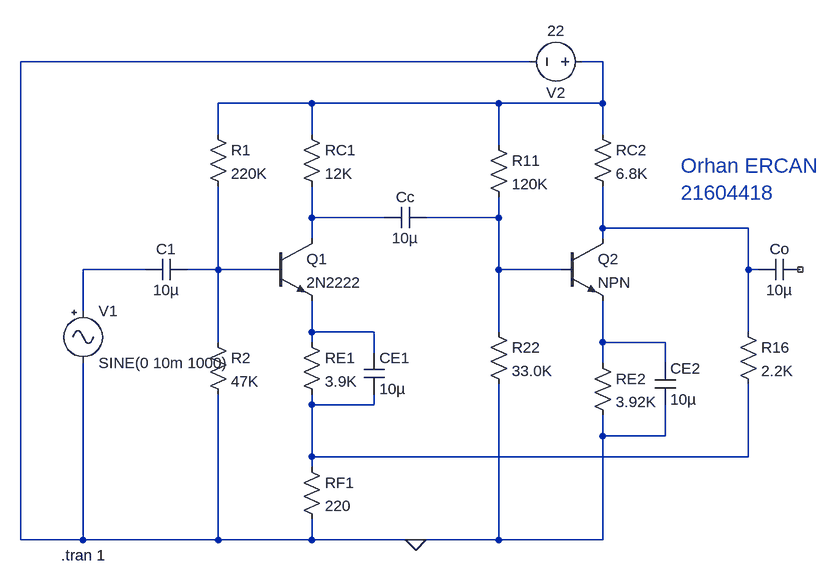
[diagram p0: schematic Draft1.asc]
Draft1.asc, the LTspice schematic file:
Version 4
SHEET 1 1160 680
WIRE 512 -144 -272 -144
WIRE 624 -144 592 -144
WIRE 176 -80 32 -80
WIRE 464 -80 176 -80
WIRE 624 -80 624 -144
WIRE 624 -80 464 -80
WIRE 32 -32 32 -80
WIRE 176 -32 176 -80
WIRE 624 -32 624 -80
WIRE 464 -16 464 -80
WIRE 176 96 176 48
WIRE 288 96 176 96
WIRE 464 96 464 64
WIRE 464 96 352 96
WIRE 624 112 624 48
WIRE 848 112 624 112
WIRE 176 128 176 96
WIRE 624 128 624 112
WIRE -80 176 -176 176
WIRE 32 176 32 48
WIRE 32 176 -16 176
WIRE 112 176 32 176
WIRE 464 176 464 96
WIRE 560 176 464 176
WIRE 848 176 848 112
WIRE 864 176 848 176
WIRE -176 240 -176 176
WIRE 176 272 176 224
WIRE 272 272 176 272
WIRE 464 272 464 176
WIRE 848 272 848 176
WIRE 32 288 32 176
WIRE 176 288 176 272
WIRE 624 288 624 224
WIRE 720 288 624 288
WIRE 272 304 272 272
WIRE 624 320 624 288
WIRE 720 320 720 288
WIRE 176 384 176 368
WIRE 272 384 272 368
WIRE 272 384 176 384
WIRE 624 432 624 400
WIRE 720 432 720 384
WIRE 720 432 624 432
WIRE 176 464 176 384
WIRE 848 464 848 352
WIRE 848 464 176 464
WIRE 176 480 176 464
WIRE -272 592 -272 -144
WIRE -176 592 -176 320
WIRE -176 592 -272 592
WIRE 32 592 32 368
WIRE 32 592 -176 592
WIRE 176 592 176 560
WIRE 176 592 32 592
WIRE 336 592 176 592
WIRE 464 592 464 352
WIRE 464 592 336 592
WIRE 624 592 624 432
WIRE 624 592 464 592
FLAG 336 592 0
SYMBOL npn 112 128 R0
SYMATTR InstName Q1
SYMATTR Value 2N2222
SYMBOL npn 560 128 R0
SYMATTR InstName Q2
SYMBOL cap -16 160 R90
WINDOW 0 0 32 VBottom 2
WINDOW 3 32 32 VTop 2
SYMATTR InstName C1
SYMATTR Value 10µ
SYMATTR SpiceLine V=6.3 Irms=0 Rser=0.001 Lser=0 mfg="TDK" pn="C3216X5ROJ106M" type="X5R"
SYMBOL cap 704 320 R0
SYMATTR InstName CE2
SYMATTR Value 10µ
SYMATTR SpiceLine V=6.3 Irms=0 Rser=0.001 Lser=0 mfg="TDK" pn="C3216X5ROJ106M" type="X5R"
SYMBOL cap 352 80 R90
WINDOW 0 0 32 VBottom 2
WINDOW 3 32 32 VTop 2
SYMATTR InstName Cc
SYMATTR Value 10µ
SYMATTR SpiceLine V=6.3 Irms=0 Rser=0.001 Lser=0 mfg="TDK" pn="C3216X5ROJ106M" type="X5R"
SYMBOL res 160 272 R0
SYMATTR InstName RE1
SYMATTR Value 3.9K
SYMATTR SpiceLine tol=1 pwr=0.1
SYMBOL res 160 -48 R0
SYMATTR InstName RC1
SYMATTR Value 12K
SYMATTR SpiceLine tol=1 pwr=0.1
SYMBOL res 16 -48 R0
SYMATTR InstName R1
SYMATTR Value 220K
SYMATTR SpiceLine tol=1 pwr=0.1
SYMBOL res 16 272 R0
SYMATTR InstName R2
SYMATTR Value 47K
SYMATTR SpiceLine tol=1 pwr=0.1
SYMBOL res 608 304 R0
SYMATTR InstName RE2
SYMATTR Value 3.92K
SYMATTR SpiceLine tol=1 pwr=0.1
SYMBOL res 608 -48 R0
SYMATTR InstName RC2
SYMATTR Value 6.8K
SYMATTR SpiceLine tol=1 pwr=0.1
SYMBOL res 448 -32 R0
SYMATTR InstName R11
SYMATTR Value 120K
SYMATTR SpiceLine tol=1 pwr=0.1
SYMBOL res 160 464 R0
SYMATTR InstName RF1
SYMATTR Value 220
SYMATTR SpiceLine tol=1 pwr=0.1
SYMBOL res 832 256 R0
SYMATTR InstName R16
SYMATTR Value 2.2K
SYMATTR SpiceLine tol=1 pwr=0.1
SYMBOL res 448 256 R0
SYMATTR InstName R22
SYMATTR Value 33.0K
SYMATTR SpiceLine tol=1 pwr=0.1
SYMBOL cap 928 160 R90
WINDOW 0 0 32 VBottom 2
WINDOW 3 32 32 VTop 2
SYMATTR InstName Co
SYMATTR Value 10µ
SYMATTR SpiceLine V=6.3 Irms=0 Rser=0.001 Lser=0 mfg="TDK" pn="C3216X5ROJ106M" type="X5R"
SYMBOL Misc\\signal -176 224 R0
WINDOW 123 0 0 Left 0
WINDOW 39 0 0 Left 0
SYMATTR InstName V1
SYMATTR Value SINE(0 10m 1000)
SYMBOL cap 256 304 R0
SYMATTR InstName CE1
SYMATTR Value 10µ
SYMATTR SpiceLine V=6.3 Irms=0 Rser=0.001 Lser=0 mfg="TDK" pn="C3216X5ROJ106M" type="X5R"
SYMBOL voltage 608 -144 R90
WINDOW 0 32 56 VTop 2
WINDOW 3 -32 56 VBottom 2
WINDOW 123 0 0 Left 0
WINDOW 39 0 0 Left 0
SYMATTR InstName V2
SYMATTR Value 22
TEXT -210 616 Left 2 !.tran 1
TEXT 744 16 Left 3 ;Orhan ERCAN\n21604418

The netlist it stands for:
* Draft1.asc
Q1 N002 N006 N007 0 2N2222
Q2 N004 N003 N008 0 NPN
C1 N006 N005 10µ V=6.3 Irms=0 Rser=0.001 Lser=0 mfg="TDK" pn="C3216X5ROJ106M" type="X5R"
CE2 N008 0 10µ V=6.3 Irms=0 Rser=0.001 Lser=0 mfg="TDK" pn="C3216X5ROJ106M" type="X5R"
Cc N003 N002 10µ V=6.3 Irms=0 Rser=0.001 Lser=0 mfg="TDK" pn="C3216X5ROJ106M" type="X5R"
RE1 N007 N009 3.9K tol=1 pwr=0.1
RC1 N001 N002 12K tol=1 pwr=0.1
R1 N001 N006 220K tol=1 pwr=0.1
R2 N006 0 47K tol=1 pwr=0.1
RE2 N008 0 3.92K tol=1 pwr=0.1
RC2 N001 N004 6.8K tol=1 pwr=0.1
R11 N001 N003 120K tol=1 pwr=0.1
RF1 N009 0 220 tol=1 pwr=0.1
R16 N004 N009 2.2K tol=1 pwr=0.1
R22 N003 0 33.0K tol=1 pwr=0.1
Co NC_01 N004 10µ V=6.3 Irms=0 Rser=0.001 Lser=0 mfg="TDK" pn="C3216X5ROJ106M" type="X5R"
V1 N005 0 SINE(0 10m 1000)
CE1 N007 N009 10µ V=6.3 Irms=0 Rser=0.001 Lser=0 mfg="TDK" pn="C3216X5ROJ106M" type="X5R"
V2 N001 0 22
.model NPN NPN
.model PNP PNP
.lib standard.bjt
.tran 1
* Orhan ERCAN
* 21604418
.backanno
.end